# Altium project 7seg-rs485-slave.PrjPcb
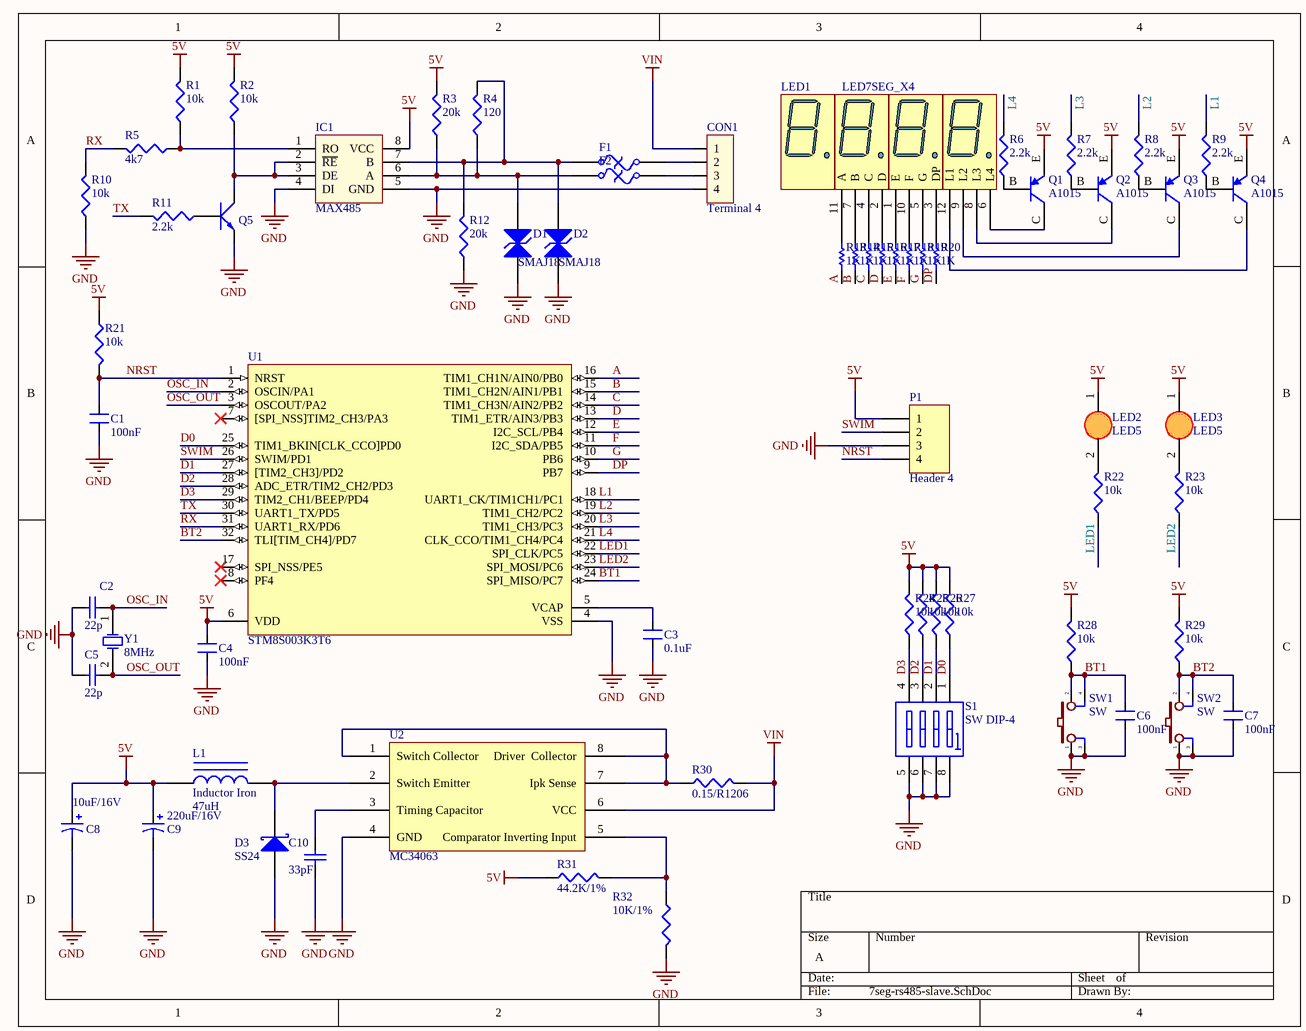
[diagram p0: 7seg-rs485-slave.SchDoc]
1 sheet, 65 parts. Net scope: global (net labels, ports and power ports of the same name join across sheets).
Board file: 7seg-rs485-slave.PcbDoc

## Sheet 7seg-rs485-slave.SchDoc
size A

### Parts
C1  100nF  [C0805]
C2  22p  [C0805]
C3  0.1uF  [C0805]
C4  100nF  [C0805]
C5  22p  [C0805]
C6  100nF  [CM 0805]
C7  100nF  [CM 0805]
C8  10uF/16V  [C1206]
C9  220uF/16V  [CAPACITOR SIZE_D(D6.6)]
C10  33pF  [C0805]
CON1  Terminal 4  [Terminal 4 5.08]
D1  SMAJ18  [DO-214AC (SMA)]
D2  SMAJ18  [DO-214AC (SMA)]
D3  SS24  [DO-214AA]
F1  JK600-150U  [PTC1812]  (value not drawn)
F2  JK600-150U  [PTC1812]  (value not drawn)
IC1  MAX485  [SO-8]
L1  Inductor Iron  value 47uH  [4848]
LED1  LED7SEG_X4  [7SEGQ]
LED2  LED5  [LED3MM]
LED3  LED5  [LED3MM]
P1  Header 4  [HDR1X4]
Q1  A1015  [SC-43-BCE]
Q2  A1015  [SC-43-BCE]
Q3  A1015  [SC-43-BCE]
Q4  A1015  [SC-43-BCE]
Q5  C1815  [2SC1815]  (value not drawn)
R1  10k  [R0805]
R2  10k  [R0805]
R3  20k  [R0805]
R4  120  [R0805]
R5  4k7  [R0805]
R6  2.2k  [R0805]
R7  2.2k  [R0805]
R8  2.2k  [R0805]
R9  2.2k  [R0805]
R10  10k  [R0805]
R11  2.2k  [R0805]
R12  20k  [R0805]
R13  1K  [R0805]
R14  1K  [R0805]
R15  1K  [R0805]
R16  1K  [R0805]
R17  1K  [R0805]
R18  1K  [R0805]
R19  1K  [R0805]
R20  1K  [R0805]
R21  10k  [R0805]
R22  10k  [R0805]
R23  10k  [R0805]
R24  10k  [R0805]
R25  10k  [R0805]
R26  10k  [R0805]
R27  10k  [R0805]
R28  10k  [R0805]
R29  10k  [R0805]
R30  0.15/R1206  [R1206]
R31  44.2K/1%  [R0805]
R32  10K/1%  [R0805]
S1  SW DIP-4  [DIP8/W0.3K]
SW1  SW  [SW4]
SW2  SW  [SW4]
U1  STM8S003K3T6  [LQFP32_N]
U2  MC34063  [SO8-150mil]
Y1  8MHz  [XT2]

### Nets
5V: C4.2 C8.1 C9.1 IC1.8(VCC) L1.1 LED2.1(A) LED3.1(A) P1.1 Q1.E Q2.E Q3.E Q4.E R1.2 R2.2 R3.2 R21.1 R24.2 R25.2 R26.2 R27.2 R28.2 R29.2 R31.1 U1.6(VDD)
GND: C1.1 C2.1 C3.1 C4.1 C5.1 C6.2 C7.2 C8.2 C9.2 C10.2 CON1.4 D1.1(A) D2.1(A) D3.1(A) IC1.4(DI) IC1.5(GND) P1.3 Q5.2(E) R10.1 R12.1 R32.2 S1.5(B4) S1.6(B3) S1.7(B2) S1.8(B1) SW1.1 SW1.3 SW2.1 SW2.3 U1.4(VSS) U2.4(GND)
VIN: CON1.1 R30.2 U2.6(VCC)
A: R13.1 U1.16(TIM1_CH1N/AIN0/PB0)
B: R14.1 U1.15(TIM1_CH2N/AIN1/PB1)
BT1: C6.1 R28.1 SW1.2 SW1.4 U1.24(SPI_MISO/PC7)
BT2: C7.1 R29.1 SW2.2 SW2.4 U1.32(TLI[TIM_CH4]/PD7)
C: R15.1 U1.14(TIM1_CH3N/AIN2/PB2)
D: R16.1 U1.13(TIM1_ETR/AIN3/PB3)
D0: R27.1 S1.1(A1) U1.25(TIM1_BKIN[CLK_CCO]PD0)
D1: R26.1 S1.2(A2) U1.27([TIM2_CH3]/PD2)
D2: R25.1 S1.3(A3) U1.28(ADC_ETR/TIM2_CH2/PD3)
D3: R24.1 S1.4(A4) U1.29(TIM2_CH1/BEEP/PD4)
DP: R20.1 U1.9(PB7)
E: R17.1 U1.12(I2C_SCL/PB4)
F: R18.1 U1.11(I2C_SDA/PB5)
G: R19.1 U1.10(PB6)
L1: R9.2 U1.18(UART1_CK/TIM1CH1/PC1)
L2: R8.2 U1.19(TIM1_CH2/PC2)
L3: R7.2 U1.20(TIM1_CH3/PC3)
L4: R6.2 U1.21(CLK_CCO/TIM1_CH4/PC4)
LED1: R22.1 U1.22(SPI_CLK/PC5)
LED2: R23.1 U1.23(SPI_MOSI/PC6)
NRST: C1.2 P1.4 R21.2 U1.1(NRST)
OSC_IN: C2.2 U1.2(OSCIN/PA1) Y1.1(OSC1)
OSC_OUT: C5.2 U1.3(OSCOUT/PA2) Y1.2(OSC2)
RX: R5.2 R10.2 U1.31(UART1_RX/PD6)
SWIM: P1.2 U1.26(SWIM/PD1)
TX: R11.2 U1.30(UART1_TX/PD5)
NetC3_2: C3.2 U1.5(VCAP)
NetC10_1: C10.1 U2.3(Timing_Capacitor)
NetCON1_2: CON1.2 F1.2
NetCON1_3: CON1.3 F2.2
NetD1_2: D1.2(K) F2.1 IC1.6(A) R3.1 R4.1
NetD2_2: D2.2(K) F1.1 IC1.7(B) R4.2 R12.2
NetD3_2: D3.2(K) L1.2 U2.2(Switch_Emitter)
NetIC1_1: IC1.1(RO) R1.1 R5.1
NetIC1_2: IC1.2(~{RE}) IC1.3(DE) Q5.3(C) R2.1
NetLED1_1: LED1.1(E) R17.2
NetLED1_2: LED1.2(D) R16.2
NetLED1_3: LED1.3(DP) R20.2
NetLED1_4: LED1.4(C) R15.2
NetLED1_5: LED1.5(G) R19.2
NetLED1_6: LED1.6(L4) Q1.C
NetLED1_7: LED1.7(B) R14.2
NetLED1_8: LED1.8(L3) Q2.C
NetLED1_9: LED1.9(L2) Q3.C
NetLED1_10: LED1.10(F) R18.2
NetLED1_11: LED1.11(A) R13.2
NetLED1_12: LED1.12(L1) Q4.C
NetLED2_2: LED2.2(K) R22.2
NetLED3_2: LED3.2(K) R23.2
NetQ1_B: Q1.B R6.1
NetQ2_B: Q2.B R7.1
NetQ3_B: Q3.B R8.1
NetQ4_B: Q4.B R9.1
NetQ5_1: Q5.1(B) R11.1
NetR30_1: R30.1 U2.1(Switch_Collector) U2.7(Ipk_Sense) U2.8(Driver__Collector)
NetR31_2: R31.2 R32.1 U2.5(Comparator_Inverting_Input)

Not connected (* = marked no-connect by the designer): U1 7([SPI_NSS]TIM2_CH3/PA3)* 8(PF4)* 17(SPI_NSS/PE5)*

### Library data of the parts
C1 C3 C4 C6 C7 = CM Ceramic: SMD Ceramic  Capacitor; Manufacturer No: C0805KRX7R9BB104; Manufacturer: Yageo; Voltage: 50V; Tolerance: 10%; Specification: ="Capacitance"+" "+"Voltage"+" " +"Tolerance"
  C1 C4 C6 C7: Capacitance: 100nF
  C3: Capacitance: 0.1uF
C2 C5 = Cap Semi: Capacitor (Semiconductor SIM Model); Published: 8-Jun-2000; LatestRevisionDate: 29-May-2009; LatestRevisionNote: IPC-7351 Footprint Added.; PackageReference: C1206; Publisher: Altium Limited; PackageDescription: Chip Capacitor
C8 C9 = Cap Pol3: Polarized Capacitor (Surface Mount); Published: 8-Jun-2000; LatestRevisionDate: 29-May-2009; LatestRevisionNote: IPC-7351 Footprint Added.; PackageReference: C0805; Publisher: Altium Limited; PackageDescription: Chip Capacitor; Supplier 1: Digi-Key
C10 = Cap Semi: Capacitor 100n 16V 0603; Published: 8-Jun-2000; LatestRevisionDate: 29-May-2009; LatestRevisionNote: IPC-7351 Footprint Added.; PackageReference: C1206; Publisher: Altium Limited; PackageDescription: Chip Capacitor
CON1 = Terminal 4: Value: Connector 4
D1 D2 = Diode_TVS
D3 = D Schottky: Schottky Diode; Published: 8-Jun-2000; LatestRevisionDate: 17-Jul-2002; LatestRevisionNote: Re-released for DXP Platform.; PackageReference: SMB; Publisher: Altium Limited; Code_JEDEC: DO-214-AA; Supplier 1: Newark; Supplier Part Number 1: 05R5881
F1 F2 = Fuse Thermal: Thermal Fuse; Published: 24-Mar-1999; LatestRevisionDate: 17-Jul-2002; LatestRevisionNote: Re-released for DXP Platform.; PackageReference: PIN-W2/E2.8; Publisher: Altium Limited
IC1 = MAX485: RS232 - RS485 (Same sn75176)
L1 = Inductor Iron: Magnetic-Core Inductor; Published: 24-Mar-1999; LatestRevisionDate: 17-Jul-2002; LatestRevisionNote: Re-released for DXP Platform.; PackageReference: AXIAL-0.9; Publisher: Altium Limited
LED2 LED3 = LED 5mm
P1 = Header 4: Header, 4-Pin; LatestRevisionDate: 17-Jul-2002; LatestRevisionNote: Re-released for DXP Platform.; Publisher: Altium Limited
Q1-Q4 = PNP Transistor
Q5 = C1815: NPN SMD Transistor; Manufacturer No: 2SC1815-HF; Manufacturer: Toshiba; Vendor: BL Galaxy Electrical; Vendor_Vietnam: TME; Value: C1815; Specification: C1815
R1 R2 R10 R21-R29 = Res3: Resistor; Manufacturer: Vishay / Draloric; Manufacturer Part Number: RCV0805301KFKEA; Power Rating: 125 mW (1/8 W); Resistance: 301 kOhms; Temperature Coefficient: 100 PPM / K; Tolerance: 1 %; Voltage Rating: 400 V; Case Height: 0.45 mm; Case Length: 2 mm; Case Width: 1.25 mm; Product Status: New Product; Published: 8-Jun-2000; LatestRevisionDate: 29-May-2009; LatestRevisionNote: IPC-7351 Footprint Added.; PackageReference: J1-0603; Publisher: Altium Limited; PackageDescription: Chip Resistor; Value: 10k; Supplier 1: Mouser; Supplier Part Number 1: 71-RCV0805301KFKEA; RoHS: RoHS Compliant; Category: Thick Film Resistors - SMD; Stock 1: 5000; Pricing 1: 1=0.330, 50=0.177, 100=0.102, 500=0.069, 1000=0.054, 5000=0.051, 10000=0.048, 15000=0.040, 25000=0.033 (USD); Operating Temperature Range: - 55 C to + 155 C; Package / Case: 0805 (2012 metric); Packaging: Reel; Product: Thick Film Resistors SMD; Series: RCV; Case Code - in: 0805; Case Code - mm: 2012; Product Category: 0805 Thick Film Chip Resistors; RoHS - Mouser: Y; Minimum Order Quantity: 1; Reeling: True; ComponentLink1URL: http://www.vishay.com/docs/20054/rcve3.pdf; ComponentLink1Description: http://www.vishay.com/docs/20054/rcve3.pdf
R3-R9 R11 R12 = Res3: Resistor; Manufacturer: Vishay / Draloric; Manufacturer Part Number: RCV0805301KFKEA; Value: 10k; Power Rating: 125 mW (1/8 W); Resistance: 301 kOhms; Temperature Coefficient: 100 PPM / K; Tolerance: 1 %; Voltage Rating: 400 V; Case Height: 0.45 mm; Case Length: 2 mm; Case Width: 1.25 mm; Product Status: New Product; Published: 8-Jun-2000; LatestRevisionDate: 29-May-2009; LatestRevisionNote: IPC-7351 Footprint Added.; PackageReference: J1-0603; Publisher: Altium Limited; PackageDescription: Chip Resistor; Supplier 1: Mouser; Supplier Part Number 1: 71-RCV0805301KFKEA; RoHS: RoHS Compliant; Category: Thick Film Resistors - SMD; Stock 1: 5000; Pricing 1: 1=0.330, 50=0.177, 100=0.102, 500=0.069, 1000=0.054, 5000=0.051, 10000=0.048, 15000=0.040, 25000=0.033 (USD); Operating Temperature Range: - 55 C to + 155 C; Package / Case: 0805 (2012 metric); Packaging: Reel; Product: Thick Film Resistors SMD; Series: RCV; Case Code - in: 0805; Case Code - mm: 2012; Product Category: 0805 Thick Film Chip Resistors; RoHS - Mouser: Y; Minimum Order Quantity: 1; Reeling: True; ComponentLink1URL: http://www.vishay.com/docs/20054/rcve3.pdf; ComponentLink1Description: http://www.vishay.com/docs/20054/rcve3.pdf
R13-R20 = Res1: RES 120 OHM 1/10W 1% 0603 SMD; Manufacturer: Yageo; Manufacturer Part Number: RC0603FR-07120RL; Published: 8-Jun-2000; LatestRevisionDate: 17-Jul-2002; LatestRevisionNote: Re-released for DXP Platform.; PackageReference: R0603; Publisher: Altium Limited; Value: 1K; Digi-Key Part Number: 311-120HRTR-ND; Unit Price: 0.00207
R30-R32 = Res3: Resistor 10k 0603; Published: 8-Jun-2000; LatestRevisionDate: 29-May-2009; LatestRevisionNote: IPC-7351 Footprint Added.; PackageReference: J1-0603; Publisher: Altium Limited; PackageDescription: Chip Resistor
S1 = SW DIP-4: DIP Switch, 4 Position, SPST; Published: 24-Mar-1999; LatestRevisionDate: 29-May-2009; LatestRevisionNote: IPC-7351 Footprint Added.; PackageVersion: Dec-2002; PackageReference: SO8; Publisher: Altium Limited; PackageDescription: 8-Pin Small Outline Integrated Circuit 1.27 mm Pitch; Code_JEDEC: MS-012-AA; Code_IPC: SOIC127P600-8
SW1 SW2 = SW4-1: Switch button 4 pin; Value: SW chip 4 pin
U1 = STM8L101K3T6: STM8S ARM-based EnergyLite 8-bit MCU, 8 kB Flash, 1.5 kB Internal RAM, -40 to +85°C Temperature, 32-pin LQFP, Tray; PackageVersion: 2010; PackageReference: LQFP32; PackageDescription: 32-Pin Low Profile Quad Flat Pack, 7 x 7 mm Body, 0.8 mm Pitch; ComponentLink1Description: Manufacturer URL; ComponentLink1URL: http://www.st.com/; ComponentLink2Description: STM8S003 Datasheet; ComponentLink2URL: http://www.st.com/internet/com/TECHNICAL_RESOURCES/TECHNICAL_LITERATURE/DATASHEET/CD00220591.pdf; ComponentLink3Description: STM8S Family Web Page; ComponentLink3URL: http://www.st.com/internet/mcu/subclass/1381.jsp
Y1 = XTAL: Crystal Oscillator; Published: 8-Jun-2000; LatestRevisionDate: 17-Jul-2002; LatestRevisionNote: Re-released for DXP Platform.; PackageReference: R38; Publisher: Altium Limited; Supplier 1: Newark; Supplier Part Number 1: 90B5422